# Altium project FE1.1S.PrjPcb
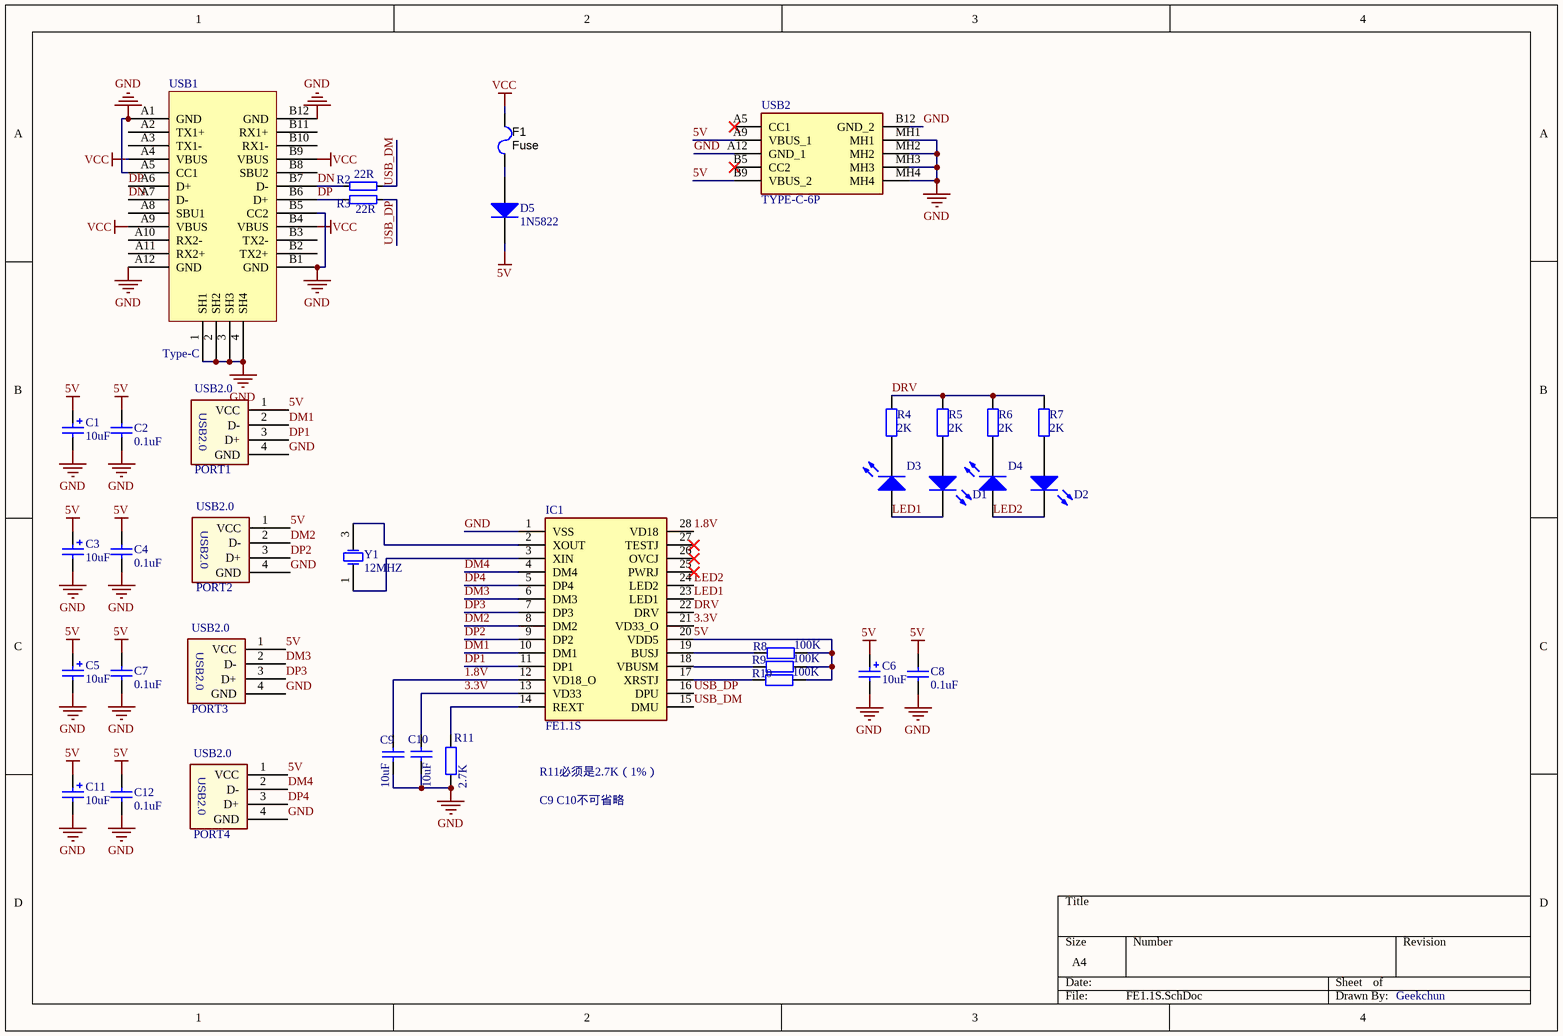
[diagram p0: FE1.1S.SchDoc]
1 sheet, 36 parts. Net scope: global (net labels, ports and power ports of the same name join across sheets).
Board files: FE1.1S.PcbDoc, FE1.1S-去丝印.PcbDoc

## Sheet FE1.1S.SchDoc
size A4

### Parts
C1  10uF  [CASE-A_3216]
C2  0.1uF  [C 0603_L]
C3  10uF  [CASE-A_3216]
C4  0.1uF  [C 0603_L]
C5  10uF  [CASE-A_3216]
C6  10uF  [CASE-A_3216]
C7  0.1uF  [C 0603_L]
C8  0.1uF  [C 0603_L]
C9  10uF  [C 0603_L]
C10  10uF  [C 0603_L]
C11  10uF  [CASE-A_3216]
C12  0.1uF  [C 0603_L]
D1  蓝灯 0603  [0603_LED_S1]  (value not drawn)
D2  蓝灯 0603  [0603_LED_S1]  (value not drawn)
D3  蓝灯 0603  [0603_LED_S1]  (value not drawn)
D4  蓝灯 0603  [0603_LED_S1]  (value not drawn)
D5  1N5822  [SMA]
F1  Fuse  [FU 1206]
IC1  FE1.1S  [SOP64P600X175-28N]
PORT1  USB2.0  [USB-A/S_A]
PORT2  USB2.0  [USB-A/S_A]
PORT3  USB2.0  [USB-A/S_A]
PORT4  USB2.0  [USB-A/S_A]
R2  22R  [R 0603_L]
R3  22R  [R 0603_L]
R4  2K  [R 0603_L]
R5  2K  [R 0603_L]
R6  2K  [R 0603_L]
R7  2K  [R 0603_L]
R8  100K  [R 0603_L]
R9  100K  [R 0603_L]
R10  100K  [R 0603_L]
R11  2.7K  [R 0603_L]
USB1  Type-C  [USB_TYPE_C_16P]
USB2  TYPE-C-6P  [USB TYPEC6P]
Y1  12MHZ  [OSC 3225-4P]

### Nets
5V: C1.1 C2.2 C3.1 C4.2 C5.1 C6.1 C7.2 C8.2 C11.1 C12.2 D5.2(K) IC1.20(VDD5) PORT1.1(VCC) PORT2.1(VCC) PORT3.1(VCC) PORT4.1(VCC) R8.1 R9.1 R10.1 USB2.A9(VBUS_1) USB2.B9(VBUS_2)
GND: C1.2 C2.1 C3.2 C4.1 C5.2 C6.2 C7.1 C8.1 C9.1 C10.1 C11.2 C12.1 IC1.1(VSS) PORT1.4(GND) PORT2.4(GND) PORT3.4(GND) PORT4.4(GND) R11.1 USB1.1(SH1) USB1.2(SH2) USB1.3(SH3) USB1.4(SH4) USB1.A1(GND) USB1.A5(CC1) USB1.A12(GND) USB1.B1(GND) USB1.B5(CC2) USB1.B12(GND) USB2.A12(GND_1) USB2.B12(GND_2) USB2.MH1 USB2.MH2 USB2.MH3 USB2.MH4
VCC: F1.1 USB1.A4(VBUS) USB1.A9(VBUS) USB1.B4(VBUS) USB1.B9(VBUS)
1.8V: C9.2 IC1.12(VD18_O) IC1.28(VD18)
3.3V: C10.2 IC1.13(VD33) IC1.21(VD33_O)
DM1: IC1.10(DM1) PORT1.2(D-)
DM2: IC1.8(DM2) PORT2.2(D-)
DM3: IC1.6(DM3) PORT3.2(D-)
DM4: IC1.4(DM4) PORT4.2(D-)
DN: R2.1 USB1.A7(D-) USB1.B7(D-)
DP: R3.1 USB1.A6(D+) USB1.B6(D+)
DP1: IC1.11(DP1) PORT1.3(D+)
DP2: IC1.9(DP2) PORT2.3(D+)
DP3: IC1.7(DP3) PORT3.3(D+)
DP4: IC1.5(DP4) PORT4.3(D+)
DRV: IC1.22(DRV) R4.2 R5.2 R6.2 R7.2
LED1: D1.K D3.A IC1.23(LED1)
LED2: D2.K D4.A IC1.24(LED2)
USB_DM: IC1.15(DMU) R2.2
USB_DP: IC1.16(DPU) R3.2
NetD1_A: D1.A R5.1
NetD2_A: D2.A R7.1
NetD3_K: D3.K R4.1
NetD4_K: D4.K R6.1
NetD5_1: D5.1(A) F1.2
NetIC1_2: IC1.2(XOUT) Y1.3(OSC2)
NetIC1_3: IC1.3(XIN) Y1.1(OSC1)
NetIC1_14: IC1.14(REXT) R11.2
NetIC1_17: IC1.17(XRSTJ) R10.2
NetIC1_18: IC1.18(VBUSM) R9.2
NetIC1_19: IC1.19(BUSJ) R8.2

Not connected (* = marked no-connect by the designer): IC1 25(PWRJ)* 26(OVCJ)* 27(TESTJ)*; USB1 A2(TX1+) A3(TX1-) A8(SBU1) A10(RX2-) A11(RX2+) B2(TX2+) B3(TX2-) B8(SBU2) B10(RX1-) B11(RX1+); USB2 A5(CC1)* B5(CC2)*

### Notes on the sheet
- R11必须是2.7K（1%）
- C9 C10不可省略
- Geekchun

### Library data of the parts
C1 C3 C5 C6 C11 = 3216 10uF (106) 10% 16V: 钽电容; ComponentLink1Description: 供应商链接; ComponentLink1URL: http://www.szlcsc.com/product/details_7643.html; Package: 3216; Supplier: LC; SuppliersPartNumber: C7171
C2 C4 C7 C8 C12 = 0603 2.2uF (225) 10% 16V: 贴片电容; ComponentLink1Description: 供应商链接; ComponentLink1URL: http://www.szlcsc.com/product/details_24366.html; Package: 0603; Supplier: LC; SuppliersPartNumber: C23630
C9 C10 = 0603 1.2nF (122) 10% 50V: 贴片电容; ComponentLink1Description: 供应商链接; ComponentLink1URL: http://www.szlcsc.com/product/details_31372.html; Package: 0603; Supplier: LC; SuppliersPartNumber: C30615
D1-D4 = 0603 蓝灯: 发光二极管; ComponentLink1Description: 供应商链接; ComponentLink1URL: http://www.szlcsc.com/product/details_73150.html; Package: 0603; Supplier: LC; SuppliersPartNumber: C72041
D5 = Diode 1N5400: 3 Amp General Purpose Rectifier; Published: 8-Jun-2000; LatestRevisionDate: 17-Jul-2002; LatestRevisionNote: Re-released for DXP Platform.; DatasheetVersion: 1998; PackageVersion: Aug-1999; PackageReference: DO-201AD; Publisher: Altium Limited; PackageDescription: Diode, Axial; Body 9.5 x 5.6 mm (LxDia. max), Lead Dia. 1.32 mm (max); ComponentLink1Description: Manufacturer Link; ComponentLink1URL: http://www.fairchildsemi.com/; ComponentLink2Description: Datasheet; ComponentLink2URL: http://www.fairchildsemi.com/ds/1N%2F1N5400.pdf
F1 = Fuse: PartNumber: NANOSMDC020F-2; Manufacturer: TE Connectivity; VDC_V: 24; Rtyp_Ohm: 1.875; SymbolCreator: a0412235; SymbolVersion: 2013-04-02; PackageReference: 1206; MountType: SMT; CompType: Fuse; RoHS: Y; Published: 2009-03-05; Publisher: Texas Instruments; LatestRevisionDate: 2015-11-23; ComponentLink1Description: Datasheet URL; ComponentLink1URL: http://www.te.com/commerce/DocumentDelivery/DDEController?Action=srchrtrv&DocNm=SCD25536&DocType=Customer+Drawing&DocLang=English; Supplier 1: Digi-Key; Supplier Part Number 1: NANOSMDC020F-2CT-ND; Supplier 2: Mouser; Supplier Part Number 2: 650-NANOSMDC020F-2; Supplier 3: Farnell; Supplier Part Number 3: 1345939
IC1 = FE1.1S: Integrated Circuit; Manufacturer_Name: JFD IC; Datasheet Link: https://cdn-shop.adafruit.com/product-files/2991/FE1.1s+Data+Sheet+(Rev.+1.0).pdf; Height: 1.75mm; Manufacturer_Part_Number: FE1.1S; Arrow Part Number: FE1.1S
PORT1-PORT4 = USB2.0_1
R2 R3 = RES
R4-R11 = 0603 1.1KΩ (1101) 1%: 贴片电阻; ComponentLink1Description: 供应商链接; ComponentLink1URL: http://www.szlcsc.com/product/details_23491.html; Package: 0603; Supplier: LC; SuppliersPartNumber: C22764
USB2 = TYPE-C-31-M-17: Connector; Manufacturer_Name: Korean Hroparts Elec; Datasheet Link: https://datasheet.lcsc.com/szlcsc/1903211732_Korean-Hroparts-Elec-TYPE-C-31-M-17_C283540.pdf; Height: 3.26mm; Manufacturer_Part_Number: TYPE-C-31-M-17; Arrow Part Number: TYPE-C-31-M-17
Y1 = SMD-3225_4P  12MHZ 20PF 10PPM: 贴片晶振; ComponentLink1Description: 供应商链接; ComponentLink1URL: http://www.szlcsc.com/product/details_9522.html; Package: SMD-3225_4P; Supplier: LC; SuppliersPartNumber: C9002